# EasyEDA Pro project ProPrj_PCB-rocket-flight-controller_2026-04-01.epro, board PCB_rocket flight controller_2
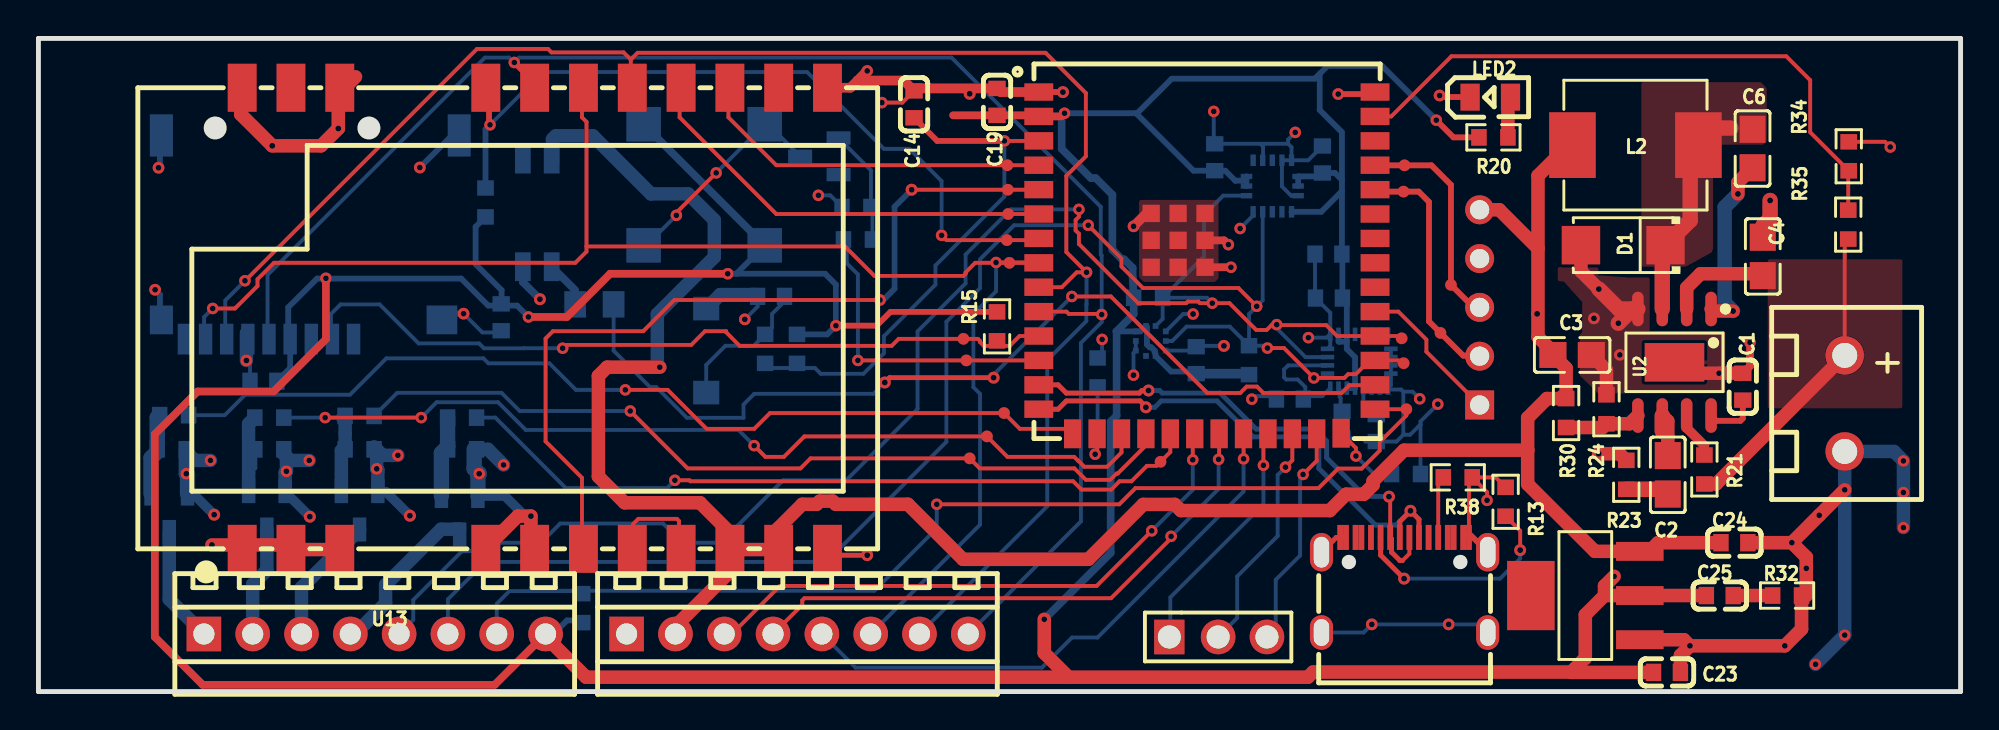
[diagram p2: board, top side]
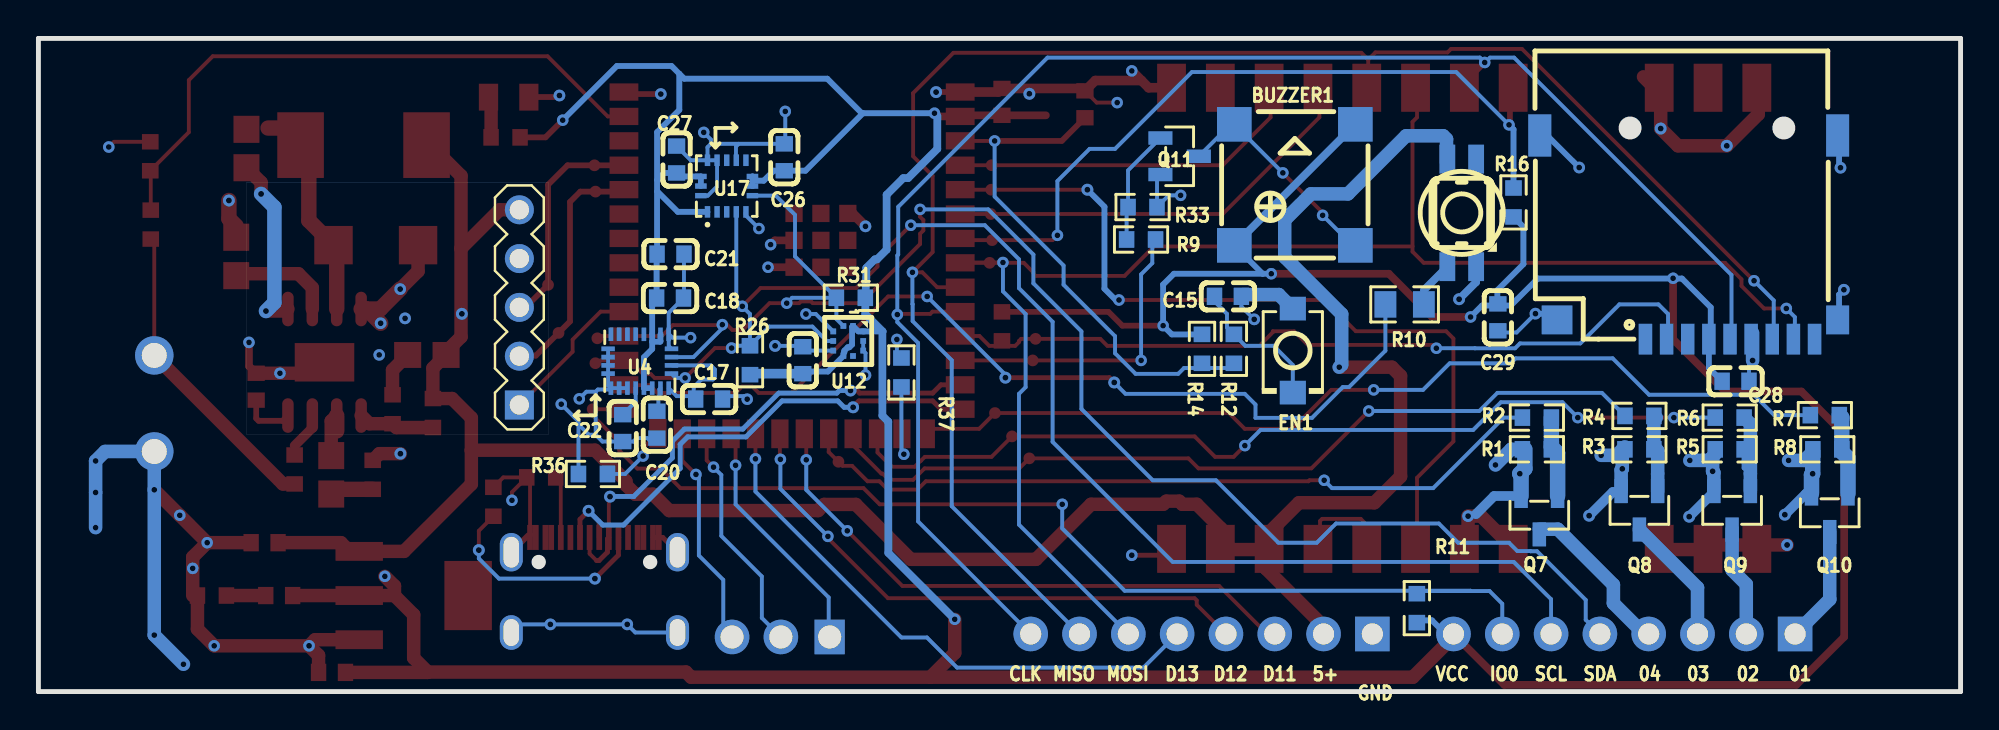
[diagram p3: board, bottom side, seen from below]

Outline 100.03 x 34 mm; copper layers: Top Layer, Inner1, Inner2, Bottom Layer. Coordinates in mm from the lower left corner of the outline.
Outline path: 0,34 100.03,34 100.03,0 0,0 0,34
Stack: Top Layer 0.035mm Outer layer thickness 1oz / Dielectric1 0.2104mm 7628 RC49% 8.6mil / Inner1 0.0152mm Inner layer thickness / Dielectric2 1.065mm 1.1mm H/HOZ Copper / Inner2 0.0152mm Inner layer thickness / Dielectric3 0.2104mm 7628 RC49% 8.6mil / Bottom Layer 0.035mm Outer layer thickness 1oz

## Design rules (mm)
net D+: DP1
net D-: DP1
template: User Custom Config
spacing Default (default): track to track 0.2, other pairs 0 to 0.305
track width Default (default): min 0.2, default 0.2, max 25.4
track width trackWidth2: min 0.7, default 0.7, max 2.54
track width trackWidthvcc: min 0.25, default 0.3, max 2.54
differential pair differentialPair (default): width min 0.127, default 0.254, max 2.54; gap min 0.152, default 0.152
via Default (default): diameter min 0.6, default 0.6, max 100.025; hole min 0.3, default 0.3, max 59.995
net VCC uses trackWidthvcc
net +5V uses trackWidth2
pour e791 uses gge18691
pour e793 uses gge18697
pour e795 uses gge18697(1)
pour e796 uses gge18745
pour e798 uses gge18751
pour e802 uses gge382696

## Placement (name value [footprint] x y rotation side)
BUZZER1  2.7kHz  [BUZ-SMD_4P-L7.5-W7.5-BR]  34.65 26.38 270 bottom
C1  100nF  [C0603]  88.7 15.87 90 top
C2  6.8nF  [C0805]  84.79 11.28 270 top
C3  47uF  [C0805]  79.81 17.52 0 top
C4  4.7uF  [C0805]  89.74 22.65 270 top
C6  10nF  [C0805]  89.2 28.27 90 top
C12  100nF  [C0603]  60.25 17.25 90 bottom
C14  1uF  [C0603]  45.57 30.57 90 top
C15  100nF  [C0603]  38.13 20.57 0 bottom
C17  100nF  [C0603]  65.13 15.23 180 bottom
C18  100nF  [C0603]  67.16 20.48 0 bottom
C19  100nF  [C0603]  49.89 30.69 90 top
C20  100nF  [C0603]  67.84 13.89 90 bottom
C21  10nF  [C0603]  67.13 22.77 180 bottom
C22  10nF  [C0603]  69.62 13.71 270 bottom
C23  100nF  [C0603]  84.75 1 180 top
C24  100nF  [C0603]  88.26 7.75 180 top
C25  22uF  [C0603]  87.5 5 0 top
C26  100nF  [C0603]  61.21 27.81 270 bottom
C27  100nF  [C0603]  66.82 27.7 90 bottom
C28  1uF  [C0603]  11.71 16.15 0 bottom
C29  1uF  [C0603]  24.08 19.48 270 bottom
CARD1  TF PUSH  [TF-SMD_TF-PUSH]  14.15 23.65 0 bottom
D1  M7  [SMA_L4.3-W2.6-LS5.2-RD]  82.47 23.24 180 top
EN1  TS-1088-AR02016  [SW-SMD_L3.9-W3.0-P4.45]  34.75 17.75 270 bottom
L2  10uH  [IND-SMD_L7.3-W6.6]  83.11 28.44 0 top
LED1  SK6812MINI-E  [LED-SMD_L3.2-W2.8-LS5.9_SK6812MINI-E]  25.96 24.92 90 bottom
LED2  NCD0805G1  [LED0805-R-RD]  75.56 30.94 0 top
NOREF  -  [Pad_e1368]  71.04 26.02 0 top
NOREF#2  -  [Pad_e1339]  71.09 27.39 0 top
NOREF#3  -  [Pad_e2091]  71.04 17.09 0 top
NOREF#4  -  [Pad_e1498]  71.19 14.7 0 top
NOREF#5  -  [Pad_e1382]  72.96 18.67 0 top
NOREF#6  -  [Pad_e1448]  50.4 23.5 0 top
NOREF#7  -  [Pad_e1465]  50.53 22.32 0 top
NOREF#8  -  [Pad_e1434]  50.47 24.86 0 top
NOREF#9  -  [Pad_e1487]  58.39 11.96 0 top
NOREF#10  -  [Pad_e527]  48.29 17.24 0 top
NOREF#11  -  [Pad_e2089]  70.94 18.39 0 top
NOREF#12  -  [Pad_e518]  48.14 18.36 0 top
NOREF#13  -  [Pad_e1485]  50.25 14.5 0 top
NOREF#14  -  [Pad_e515]  48.46 12.14 0 top
NOREF#15  -  [Pad_e1402]  50.45 26.12 0 top
NOREF#16  -  [Pad_e514]  49.36 13.28 0 top
NOREF#17  -  [Pad_e1417]  50.42 27.4 0 top
NOREF#18  -  [Pad_e1381]  73.51 21.17 0 top
P2  WJ126V-5.0-2P  [CONN-TH_WJ126V-5.0-2P]  94 15 0 top
Q7  IRLML6344TRPBF-HXY  [SOT-23-3_L2.9-W1.3-P1.90-LS2.4-BR-1]  21.92 9.18 90 bottom
Q8  IRLML6344TRPBF-HXY  [SOT-23-3_L2.9-W1.3-P1.90-LS2.4-BR-1]  16.71 9.43 90 bottom
Q9  IRLML6344TRPBF-HXY  [SOT-23-3_L2.9-W1.3-P1.90-LS2.4-BR-1]  11.89 9.43 90 bottom
Q10  IRLML6344TRPBF-HXY  [SOT-23-3_L2.9-W1.3-P1.90-LS2.4-BR-1]  6.81 9.31 90 bottom
Q11  IRLML6344TRPBF-HXY  [SOT-23-3_L2.9-W1.3-P1.90-LS2.4-BR-1]  40.64 27.86 0 bottom
R1  10kΩ  [R0603]  22.05 12.61 180 bottom
R2  100Ω  [R0603]  22.05 14.26 0 bottom
R3  10kΩ  [R0603]  16.71 12.61 180 bottom
R4  100Ω  [R0603]  16.71 14.35 0 bottom
R5  10kΩ  [R0603]  12.02 12.61 180 bottom
R6  100Ω  [R0603]  12.02 14.26 0 bottom
R7  100Ω  [R0603]  7.06 14.39 0 bottom
R8  10kΩ  [R0603]  6.94 12.61 180 bottom
R9  100Ω  [R0603]  42.65 23.53 180 bottom
R10  330Ω  [R0805]  28.93 20.15 0 bottom
R11  10kΩ  [R0603]  28.3 4.34 90 bottom
R12  470Ω  [R0603]  37.82 17.84 270 bottom
R13  5.1kΩ  [R0603]  76.35 9.88 90 top
R14  10kΩ  [R0603]  39.48 17.84 90 bottom
R15  10kΩ  [R0603]  49.89 19.01 90 top
R16  10kΩ  [R0603]  23.27 25.46 90 bottom
R20  470Ω  [R0603]  75.72 28.85 180 top
R21  100kΩ  [R0603]  86.7 11.56 270 top
R23  6.8kΩ  [R0603]  82.63 11.28 90 top
R24  10kΩ  [R0603]  81.6 14.7 270 top
R26  4.7kΩ  [R0603]  63 17.25 270 bottom
R30  44.2kΩ  [R0603]  79.5 14.5 90 top
R31  4.7kΩ  [R0603]  57.75 20.5 180 bottom
R32  1Ω  [R0603]  91 5 0 top
R33  10kΩ  [R0603]  42.57 25.22 180 bottom
R34  68kΩ  [R0603]  94.21 27.86 270 top
R35  180kΩ  [R0603]  94.18 24.31 270 top
R36  10kΩ  [R0603]  71.17 11.33 180 bottom
R37  10kΩ  [R0603]  55.12 16.61 90 bottom
R38  5.1kΩ  [R0603]  73.86 11.15 180 top
SERVO3  77311-102-03LF  [HDR-TH_3P-P2.54-V-M-1]  61.39 2.84 0 top
U2  MP1484  [SOP-8_L4.9-W3.9-P1.27-LS6.0-BL-EP3.1]  85.14 17.14 180 top
U4  LSM9DS1TR  [LGA-24_L3.5-W3.0-P0.43-TL]  68.73 17.19 0 bottom
U5  ESP32-S3-WROOM-1U-N8  [WIRELM-SMD_ESP32-S3-WROOM-1U]  60.81 22.31 0 top
U6  GPS Module GPS NEO-6M  [GPS MODULE GPS NEO-6M]  75 20 0 bottom
U12  BMP581  [LGA-10_L2.0-W2.0-P0.50-TL_BMP581]  57.89 18.25 270 bottom
U13  DB125-2.54-8P-GN-S  [CONN-TH_DB125-2.54-8P-GN]  17.5 3 0 top
U15  DB125-2.54-8P-GN-S  [CONN-TH_DB125-2.54-8P-GN]  39.5 3 0 top
U16  AMS1117-3.3  [SOT-223-4_L6.5-W3.5-P2.30-LS7.0-BR]  80.5 5 0 top
U17  H3LIS331DLTR  [LGA-16_L3.0-W3.0-P0.50-BL]  64.21 26.31 180 bottom
U18  E220-900M30S  [WIRELM-SMD_E22-900M30S]  25.83 19.43 270 top
USBC1  TYPE-C-31-M-12  [USB-C_SMD-TYPE-C-31-M-12]  71.1 5.55 0 top

## Footprints (pads in the part's own frame, mm; a bottom-side part is the same pattern mirrored in y, then rotated)
BUZ-SMD_4P-L7.5-W7.5-BR
  rect 1.8x1.8 smd: 1(3.15,-3.15) 2(3.15,3.15) 3(-3.15,3.15) 4(-3.15,-3.15)
C0603
  rect 0.8x0.9 smd: 1(-0.7,0) 2(0.7,0)
C0805
  rect 1.41x1.35 smd: 1(-1,0) 2(1,0)
CONN-TH_DB125-2.54-8P-GN
  rect 1.8x1.8 hole 1.1: 1(-8.89,0)
  round 1.8 hole 1.1: 2(-6.35,0) 3(-3.81,0) 4(-1.27,0) 5(1.27,0) 6(3.81,0) 7(6.35,0) 8(8.89,0)
CONN-TH_WJ126V-5.0-2P
  round 2 hole 1.3: 1(0,2.501) 2(0,-2.501)
GPS MODULE GPS NEO-6M
  rect 1.508x1.508 hole 1x1: 1(0,5.08)
  round 1.508 hole 1x1: 2(0,2.54) 3(0,0) 4(0,-2.54) 5(0,-5.08)
HDR-TH_3P-P2.54-V-M-1
  rect 1.575x1.8 hole 1.2: 1(-2.54,0)
  round 1.8 hole 1.2: 2(0,0) 3(2.54,0)
IND-SMD_L7.3-W6.6
  rect 2.424x3.42 smd: 1(3.278,0) 2(-3.278,0)
LED0805-R-RD
  rect 1x1.399 smd: 1(1.05,0) 2(-1.05,0)
LED-SMD_L3.2-W2.8-LS5.9_SK6812MINI-E
  rect 1.5x0.82 smd: 1(2.8,0.75) 2(2.8,-0.75) 3(-2.8,-0.75) 4(-2.8,0.75)
LGA-10_L2.0-W2.0-P0.50-TL_BMP581
  rect 0.3x0.3 smd: 1(-0.78,0.25) 2(-0.78,-0.25) 3(-0.5,-0.78) 4(0,-0.78) 5(0.5,-0.78) 6(0.78,-0.25) 7(0.78,0.25) 8(0.5,0.78) 9(0,0.78) 10(-0.5,0.78)
LGA-16_L3.0-W3.0-P0.50-BL
  rect 0.28x0.6 smd: 1(-1,-1.343) 2(-0.5,-1.343) 3(0,-1.343) 4(0.5,-1.343) 5(1,-1.343) 9(1,1.343) 10(0.5,1.343) 11(0,1.343) 12(-0.5,1.343) 13(-1,1.343)
  rect 0.6x0.28 smd: 6(1.343,-0.5) 7(1.343,0) 8(1.343,0.5) 14(-1.343,0.5) 15(-1.343,0) 16(-1.343,-0.5)
LGA-24_L3.5-W3.0-P0.43-TL
  rect 0.241x0.7 smd: 1(-1.505,1.4) 6(-1.505,-1.4) 7(-1.075,-1.4) 8(-0.645,-1.4) 9(-0.215,-1.4) 10(0.215,-1.4) 11(0.645,-1.4) 12(1.075,-1.4) 13(1.505,-1.4) 18(1.505,1.4) 19(1.075,1.4) 20(0.645,1.4) 21(0.215,1.4) 22(-0.215,1.4) 23(-0.645,1.4) 24(-1.075,1.4)
  rect 0.7x0.241 smd: 2(-1.65,0.645) 3(-1.65,0.215) 4(-1.65,-0.215) 5(-1.65,-0.645) 14(1.65,-0.645) 15(1.65,-0.215) 16(1.65,0.215) 17(1.65,0.645)
Pad_e514
  round 0.61 smd: TP1(0,0)
Pad_e515
  round 0.61 smd: TP2(0,0)
Pad_e518
  round 0.61 smd: TP3(0,0)
Pad_e527
  round 0.61 smd: TP4(0,0)
Pad_e1339
  round 0.61 smd: TP1(0,0)
Pad_e1368
  round 0.61 smd: TP2(0,0)
Pad_e1381
  round 0.61 smd: TP3(0,0)
Pad_e1382
  round 0.61 smd: TP4(0,0)
Pad_e1402
  round 0.61 smd: TP5(0,0)
Pad_e1417
  round 0.61 smd: TP6(0,0)
Pad_e1434
  round 0.61 smd: TP7(0,0)
Pad_e1448
  round 0.61 smd: TP8(0,0)
Pad_e1465
  round 0.61 smd: TP9(0,0)
Pad_e1485
  round 0.61 smd: TP11(0,0)
Pad_e1487
  round 0.61 smd: TP13(0,0)
Pad_e1498
  round 0.61 smd: TP14(0,0)
Pad_e2089
  round 0.61 smd: TP1(0,0)
Pad_e2091
  round 0.61 smd: TP2(0,0)
R0603
  rect 0.806x0.864 smd: 1(-0.753,0) 2(0.753,0)
R0805
  rect 1.133x1.377 smd: 1(-1,0) 2(1,0)
SMA_L4.3-W2.6-LS5.2-RD
  rect 2x2 smd: 1(-2.2,0) 2(2.2,0)
SOP-8_L4.9-W3.9-P1.27-LS6.0-BL-EP3.1
  oval 0.6x1.8 smd: 1(-1.905,-2.772) 2(-0.635,-2.772) 3(0.635,-2.772) 4(1.905,-2.772) 5(1.905,2.772) 6(0.635,2.772) 7(-0.635,2.772) 8(-1.905,2.772)
  rect 3.1x2 smd: 9(0,0)
SOT-23-3_L2.9-W1.3-P1.90-LS2.4-BR-1
  rect 1.25x0.7 smd: 1(1,-0.95) 2(1,0.95) 3(-1,0)
SOT-223-4_L6.5-W3.5-P2.30-LS7.0-BR
  rect 2.47x0.98 smd: 1(2.835,-2.3) 2(2.835,0) 3(2.835,2.3)
  rect 2.47x3.6 smd: 4(-2.835,0)
SW-SMD_L3.9-W3.0-P4.45
  rect 1.23x1.36 smd: 1(-2.185,0) 2(2.185,0)
TF-SMD_TF-PUSH
  rect 0.7x1.6 smd: 1(2.25,5.3) 2(1.15,5.3) 3(0.05,5.3) 4(-1.05,5.3) 5(-2.15,5.3) 6(-3.25,5.3) 7(-4.35,5.3) 8(-5.45,5.3) CD(-6.55,5.3)
  rect 1.2x1.5 smd: 10(-7.75,4.3)
  rect 1.2x2.2 smd: 11(-7.75,-5.3) 12(7.75,-5.3)
  rect 1.6x1.5 smd: 13(6.85,4.3)
USB-C_SMD-TYPE-C-31-M-12
  oval 1.2x2 hole 0.8x1.6: 0(-4.325,1.706) 1(4.325,1.706)
  oval 1.2x1.8 hole 0.8x1.4: 2(4.325,-2.474) 3(-4.325,-2.474)
  rect 0.3x1.3 smd: A1(-3.35,2.474) A4(-2.55,2.474) A5(-1.25,2.474) A6(-0.25,2.474) A7(0.25,2.474) A8(1.25,2.474) A9(2.55,2.474) A12(3.35,2.474) B1(3.05,2.474) B4(2.25,2.474) B5(1.75,2.474) B6(0.75,2.474) B7(-0.75,2.474) B8(-1.75,2.474) B9(-2.25,2.474) B12(-3.05,2.474)
WIRELM-SMD_E22-900M30S
  rect 2.5x1.5 smd: 1(12,-15.23) 2(12,-12.69) 3(12,-10.15) 4(12,-2.55) 5(12,-0.01) 6(12,2.53) 7(12,5.07) 8(12,7.61) 9(12,10.15) 10(12,12.69) 11(12,15.23) 12(-12,15.23) 13(-12,12.69) 14(-12,10.15) 15(-12,7.61) 16(-12,5.07) 17(-12,2.53) 18(-12,-0.01) 19(-12,-2.55) 20(-12,-10.15) 21(-12,-12.69) 22(-12,-15.23)
WIRELM-SMD_ESP32-S3-WROOM-1U
  rect 1.5x0.9 smd: 1(-8.75,8.895) 2(-8.75,7.625) 3(-8.75,6.355) 4(-8.75,5.085) 5(-8.75,3.815) 6(-8.75,2.545) 7(-8.75,1.275) 8(-8.75,0.005) 9(-8.75,-1.265) 10(-8.75,-2.535) 11(-8.75,-3.805) 12(-8.75,-5.075) 13(-8.75,-6.345) 14(-8.75,-7.615) 27(8.75,-7.615) 28(8.75,-6.345) 29(8.75,-5.075) 30(8.75,-3.805) 31(8.75,-2.535) 32(8.75,-1.265) 33(8.75,0.005) 34(8.75,1.275) 35(8.75,2.545) 36(8.75,3.815) 37(8.75,5.085) 38(8.75,6.355) 39(8.75,7.625) 40(8.75,8.895)
  rect 0.9x1.5 smd: 15(-6.985,-8.895) 16(-5.715,-8.895) 17(-4.445,-8.895) 18(-3.175,-8.895) 19(-1.905,-8.895) 20(-0.635,-8.895) 21(0.635,-8.895) 22(1.905,-8.895) 23(3.175,-8.895) 24(4.445,-8.895) 25(5.715,-8.895) 26(6.985,-8.865)
  rect 0.9x0.9 smd: 41(-2.9,2.575) 41(-2.9,1.175) 41(-2.9,-0.225) 41(-1.5,2.575) 41(-1.5,1.175) 41(-1.5,-0.225) 41(-0.1,2.575) 41(-0.1,1.175) 41(-0.1,-0.225)

## Nets
+5V: C3.1 C24.2 L2.2 LED1.1 R30.2 U6.5 U15.2 U16.3 U18.9 U18.10
GND: C1.2 C3.2 C4.1 C12.2 C14.2 C15.1 C17.2 C18.1 C19.2 C20.1 C21.2 C22.2 C23.1 C24.1 C26.1 C27.2 C28.1 C29.2 CARD1.6 CARD1.10 CARD1.11 CARD1.12 CARD1.13 D1.2 EN1.1 LED1.3 LED2.2 P2.2 Q7.2 Q8.2 Q9.2 Q10.2 Q11.2 R1.1 R3.1 R5.1 R8.1 R13.2 R23.2 R24.1 R32.2 R33.2 R34.1 R36.1 R37.2 R38.1 U2.4 U2.9 U4.5 U4.6 U4.14 U4.15 U4.16 U4.17 U4.18 U4.19 U4.20 U5.1 U5.40 U5.41 U6.4 U12.3 U12.5 U12.8 U12.9 U15.1 U16.1 U17.5 U17.10 U17.12 U17.13 U17.16 U18.1 U18.2 U18.3 U18.4 U18.5 U18.11 U18.12 U18.20 U18.22 USBC1.0 USBC1.1 USBC1.2 USBC1.3 USBC1.A1 USBC1.A12 USBC1.B1 USBC1.B12
VBATT: C4.2 P2.1 R21.2 R35.2 U2.2
VCC: BUZZER1.1 BUZZER1.3 C12.1 C18.2 C19.1 C21.1 C23.2 C25.1 C26.2 C27.1 C28.2 C29.1 CARD1.4 R11.1 R14.2 R15.2 R16.1 R20.2 R26.2 R31.2 U4.7 U4.8 U4.22 U4.23 U5.2 U12.1 U12.6 U12.10 U13.8 U16.2 U17.1 U17.7 U17.8 U17.14 U17.15
CLK: CARD1.5 U5.10 U15.8 U18.18
D03PIRO1: NOREF#13.TP11 R7.2 U5.15
D4BUSY: NOREF#17.TP6 U5.4 U18.14
D5RXEN: NOREF#15.TP5 U5.5 U18.6
D6NRST: NOREF#8.TP7 U5.6 U18.15
D7CS(LORA): NOREF#6.TP8 R16.2 U5.7 U18.19
D8BUZZERPIN: NOREF#10.TP4 R9.2 U5.12
D9PIRO3: NOREF#14.TP2 R4.2 U5.18
D10PIRO4: NOREF#9.TP13 R2.2 U5.19
D12SERVO1: U5.20 U15.3
D13SERVO2: U5.21 U15.4
D14SERVO3: U5.22 U15.5
D18CSSDCARD: CARD1.2 NOREF#12.TP3 R15.1 U5.11
D21: SERVO3.1 U5.23
D39LED: R10.2 U5.28
D40SCL: NOREF#3.TP2 R26.1 U4.2 U5.29 U12.4 U13.6 U17.4
D41SDA: NOREF#11.TP1 R31.1 U4.4 U5.30 U12.2 U13.5 U17.6
D46PIRO2: NOREF#16.TP1 R6.2 U5.17
D47: SERVO3.2 U5.24
D48: SERVO3.3 U5.25
D+: U5.14 USBC1.A6 USBC1.B6
D-: U5.13 USBC1.A7 USBC1.B7
EN: C14.1 R12.2 R14.1 U5.3
IO0: NOREF#4.TP14 R11.2 U5.27 U13.7
MISO: CARD1.7 U5.9 U15.7 U18.16
MOSI: CARD1.8 NOREF#7.TP9 U5.8 U15.6 U18.17
PIRO1-: Q10.3 U13.1
PIRO2-: Q9.3 U13.2
PIRO3-: Q8.3 U13.3
PIRO4-: Q7.3 U13.4
PPS: U5.31 U6.1
RX: NOREF.TP2 NOREF#5.TP4 U5.36 U6.2
TX: NOREF#2.TP1 NOREF#18.TP3 U5.37 U6.3
V: R34.2 R35.1 U5.39
$1N5: C15.2 EN1.2 R12.1
$1N13: R21.1 U2.7
$1N14: C1.1 U2.8
$1N15: C2.1 U2.6
$1N16: C6.2 D1.1 L2.1 U2.3
$1N18: R24.2 R30.1 U2.5
$1N20: C6.1 U2.1
$1N1285: C2.2 R23.1
$1N7934: C25.2 R32.1
$1N12300: U18.7 U18.8
$1N13611: R36.2 U5.26
$1N13616: R37.1 U5.16
$1N14866: R13.1 USBC1.A5
$1N14869: R38.2 USBC1.B5
$2N1: Q7.1 R1.2 R2.1
$2N2: Q8.1 R3.2 R4.1
$2N3: Q9.1 R5.2 R6.1
$2N4: Q10.1 R7.1 R8.2
$2N19: C17.1 U4.1 U4.3
$2N22: C20.2 U4.24
$2N907: LED1.4 R10.1
$2N956: LED2.1 R20.1
$2N973: C22.1 U4.21
$2N3959: BUZZER1.2 BUZZER1.4 Q11.3
$2N14318: Q11.1 R9.1 R33.1

Pads without a net: CARD1 1 3 CD; LED1 2; U4 9 10 11 12 13; U5 32 33 34 35 38; U12 7; U16 4; U17 2 3 9 11; U18 13 21; USBC1 A4 A8 A9 B4 B8 B9

## Via types
v1: diameter 0.6, hole 0.3, Top Layer to Bottom Layer, 80 vias
v2: diameter 0.61, hole 0.305, Top Layer to Bottom Layer, 20 vias
v3: diameter 0.62, hole 0.31, Top Layer to Bottom Layer, 25 vias
v4: diameter 0.6, hole 0.31, Top Layer to Bottom Layer, 2 vias

## Routing (per net, layer and track width the routed paths; a pad name or vN(x,y) marks a point on that pad's centre or on a via; arc(x,y) is an arc through that point)
+5V: length 126.4
  Top Layer w0.7: 38.5,7.07 38.5,8.5 39.75,9.75 40.5,9.75 40.66,9.91 41.33,9.91 41.49,9.75 45.25,9.75 48.11,6.88 54.64,6.88 57.49,9.74 59.14,9.74 59.46,9.42 67.2,9.42 68.05,10.27 68.97,10.27 69.45,10.75 69.45,10.95 71.07,12.56 77.5,12.56 ; 78.04,23.07 76.03,25.08 U6.5 ; 78.04,23.07 78.04,26.85 79.76,28.57 ; 78.04,23.07 78.04,18.46 78.81,17.68 ; C3.1 79.5,16.84 R30.2 78.5,15.25 77.5,14.25 77.5,12.56 ; 77.5,12.56 77.5,10.8 81,7.3 83.33,7.3 ; v1(32.33,16.88) 29.59,16.88 29.14,16.43 29.14,11.19 30.51,9.83 34.43,9.83 36.15,8.11 36.15,7.39 ; U15.2 33.15,3.4 36.15,6.4 36.15,7.39 ; 36.15,7.39 38.45,7.39 ; 83.83,7.3 84.29,7.75 C24.2
  Bottom Layer w0.7: v1(32.33,16.88) 32.21,17.01 32.21,19.65 35.17,22.61 35.17,24.54 33.81,25.91 31.88,25.91 28.85,28.93 26.92,28.93 26.75,28.76 26.75,27.55
  vias: v3(77.99,19.66)
GND: length 216.4
  Top Layer w0.2: USBC1.A12 74.45,10.98 R38.1 ; R38.1 75.84,11.15 R13.2 ; R38.1 75.39,10.38 v1(75.39,9.96) ; USBC1.B1 74.3,8.17 ; 94.21,28.62 96.1,28.62 v1(96.37,28.35) ; C14.2 44.96,30.66 v1(43.89,30.66)
  Top Layer w0.254: USBC1.B12 USBC1.A1 67.54,8.02 USBC1.0 ; v2(43.13,7.1) 41.28,7.1 40.99,7.39
  Top Layer w0.3: v2(72.92,31.03) 73,30.95 74.5,30.95 LED2.2 ; v2(67.64,31.1) 69.17,31.1 69.17,31.1 ; U5.1 53.31,31.21 v3(53.32,31.2) ; USBC1.1 74.55,8.13
  Top Layer w0.4: U5.41 v1(62.06,22.09) ; v1(89.07,18.18) 89.07,16.95 C1.2 ; v1(61.93,23.27) 61.7,23.49 U5.41
  Top Layer w0.5: U18.12 42.25,31.43 42.63,31.81 ; C14.2 45.03,31.81 42.63,31.81 ; 42.63,31.81 v1(43.13,32.31) ; U5.41 57.66,24.89 v2(56.99,24.22) ; 45.7,31.39 C19.2 50.07,31.21 U5.1
  Top Layer w0.7: v2(85.95,2.38) 85.45,1.89 C23.1 ; v2(85.95,2.38) v1(90.88,2.38) 91.75,3.25 91.75,5 ; v2(85.95,2.38) 85.63,2.7 83.33,2.7 ; C24.1 v1(91.25,7.75) ; v1(91.25,7.75) 92,7 v1(92,6.41) 92,5 ; v1(91.25,7.75) v1(92.67,9.18) v1(94,10.5) ; R24.1 81.6,16.74 C3.2 ; 25.8,7.07 25.63,7.24 v2(25.63,9.13) 24.95,9.13 23.21,7.39 ; 10.53,31.39 10.53,30.05 v3(12.17,28.41) 14.71,28.41 v3(15.61,29.31) 15.61,31.1 16.5,32 ; U2.9 85.71,16.57 v1(87.46,16.57) C1.2 ; v2(81.2,20.95) 80.27,21.88 80.27,23.24 ; v3(81.19,12.38) 82.29,12.38 R23.2 ; 15.61,7.39 13.07,7.39 12.83,7.63 v3(9.03,7.63)
  Top Layer w0.8: v2(81.2,20.95) 82.24,19.91 82.96,19.91 ; v3(90.12,25.56) 90.12,24.62 89.74,24.24 ; 82.96,19.91 v2(82.22,19.17) ; 82.96,19.91 83.24,19.91
  Bottom Layer w0.2: 66.43,22.77 66.43,20.51 C18.1 67.23,19.71 U4.6 67.23,17.98 U4.5 ; 71.03,15.61 70.92,15.72 70.31,15.72 U4.18 ; 71.03,15.61 71.51,15.61 v1(71.88,15.24) ; 71.03,15.61 71.03,13.37 ; Q11.2 41.82,26.74 R33.2 41.21,25.83 v1(40.59,25.83) ; USBC1.2 75,3.5 v2(73.39,3.5) v2(69.39,3.5) 68.96,3.07 USBC1.3 ; U4.18 70.38,15.94 U4.17 U4.16 U4.15 U4.14 ; U4.18 U4.19 U4.20 ; U17.13 66.08,27.66 C27.2 ; U17.13 U17.12 64.71,26.3 65.19,25.81 U17.16 ; U17.13 65.21,28.34 65.04,28.51 ; 60.3,18.06 60.37,17.99 v3(61.69,17.99) ; R36.1 71.92,13.91 ; 71.92,13.91 71.92,14.06 v1(72.82,14.96) ; 71.92,13.91 71.38,13.37 71.03,13.37 ; U12.5 59.99,17.75 60.3,18.06 ; 65.04,28.51 65.04,28.74 v1(65.41,29.11) ; 65.04,28.51 63.59,28.51 ; v1(63.14,15.22) 63.3,15.38 64.53,15.38 ; 71.03,13.37 70.67,13.01 C22.2 69.06,13.01 68.88,13.19 68.34,13.19 68.16,13.01 67.79,13.01 67.77,13.04 ; v1(61.16,30.2) 61.16,28.56 C26.1 63.59,28.51 ; 24.11,18.69 23.1,18.69 v2(22.12,19.67) ; 55.12,17.29 55.36,17.52 v1(55.36,18.33) ; 63.59,28.51 63.73,28.37 63.73,27.67 U17.10 ; U12.9 U12.8 ; v1(66.09,18.42) 67.04,18.42 67.21,18.59 ; v1(62.54,24.1) 63.21,24.78 U17.5 ; v4(60.09,19.65) 59.57,19.65 U12.3 ; v3(10.82,17.23) 11.01,17.05 C28.1 ; 57.11,17.74 56.99,17.62 v4(56.99,16.47) ; v2(36.76,19.38) 37.43,20.04 C15.1
  Bottom Layer w0.3: v2(6.07,20.92) 6.32,20.66 6.32,19.66 ; 20.92,19.66 22.12,19.66 v2(22.12,19.67) ; v2(19.85,27.28) 21.82,29.25 21.82,29.26 ; 6.32,29.26 6.32,27.34 v2(6.25,27.27)
  Bottom Layer w0.4: v3(26.1,20.42) 25.21,21.31 LED1.3
  Bottom Layer w0.5: Q7.2 24.27,10.18 25.22,9.23 ; 12.84,10.39 v3(14.12,9.1) ; v3(19.33,9.16) 18.1,10.39 17.66,10.39 ; Q10.2 8.04,10.31 v3(9.14,9.21)
  Bottom Layer w0.7: EN1.1 35.48,20.67 37.33,20.67 ; 12.77,12.36 13.09,12.03 v1(14.09,12.03) ; 10.82,18.66 v3(10.82,17.23) ; 17.6,12.6 v2(17.6,11.59) 17.66,11.53 Q8.2 ; v1(97.05,8.53) v1(97.05,10.36) v1(97.05,12.01) 96.56,12.5 P2.2 v1(94,10.5) v1(94,2.94) v1(92.48,1.42) ; Q9.2 12.84,11.4 v2(12.9,11.47) 12.9,12.22 ; 7.69,12.48 8.14,12.03 v1(8.95,12.03) ; v1(24.2,11.8) 23.39,12.61 22.67,12.61 ; 17.47,12.74 17.91,12.3 v1(18.7,12.3)
  Bottom Layer w0.8: Q10.2 7.76,11.28 v2(7.7,11.34) 7.69,12.48 ; 22.67,12.61 22.67,11.6 v2(22.94,11.34) 22.87,11.27 Q7.2
  vias: v1(82.3,17.52) v2(80.95,19.43) v3(48.46,31.12)
VBATT: length 21.6
  Top Layer w0.2: P2.1 94,23.37 R35.2
  Top Layer w0.7: P2.1 87.31,10.81 R21.2 ; 85.78,19.91 85.78,21 ; C4.2 89.64,21.75 86.5,21.75 85.78,21.02
VCC: length 288.1
  Top Layer w0.3: R20.2 73.64,28.85 v1(72.75,29.74) ; 49.89,19.76 44.34,19.76 43.62,19.05 v1(41.5,19.05)
  Top Layer w0.4: v1(53.4,30.1) 53.23,29.94 52.06,29.94 52,29.99 C19.1 47.6,29.99 ; U13.8 23.74,0.35 8.55,0.35 6.06,2.84 6.06,13.4 8.28,15.62 12.24,15.62 14.96,18.34 v1(14.96,21.51) ; v1(35.87,21.75) 29.75,21.75 27.5,19.5 v1(25.5,19.5)
  Top Layer w0.7: 81.5,5 80.5,4 80.5,1.75 79.77,1.02 ; 81.5,5 81.5,5.5 v1(82,6) ; 81.5,5 C25.1 ; 53.61,0.75 52.34,2.01 v1(52.34,3.76) ; 53.61,0.75 66.06,0.75 66.33,1.02 79.77,1.02 ; 53.61,0.75 28.5,0.75 26.39,2.86 U13.8 ; 79.77,1.02 79.79,1 C23.2
  Bottom Layer w0.3: 66.68,32.16 66.68,30.27 67.83,29.12 67.83,26.63 ; 66.68,32.16 66.42,31.9 58.98,31.9 57.18,30.1 57.12,30.1 ; 66.68,32.16 67.08,32.56 69.93,32.56 v1(72.75,29.74) ; U17.15 U17.14 66.64,26.81 C27.1 67.47,27 67.83,26.63 ; 68.09,18.21 68.09,17.83 68.52,17.4 U4.22 68.17,15.79 ; 68.09,18.21 67.68,18.21 67.66,18.23 U4.7 ; 68.09,18.21 U4.8 68.09,20.25 C18.2 67.86,22.74 C21.1 67.83,26.02 ; 36.32,21.75 v1(35.87,21.75) ; 36.32,21.75 BUZZER1.1 ; 36.32,21.75 40.94,21.75 41.5,21.19 v1(41.5,19.05) 41.05,18.59 R14.2 ; 67.83,26.63 67.83,26.02 ; 13.02,18.66 13,18.69 13,20 14.5,21.5 22,21.5 23.41,20.09 24.11,20.09 ; 67.83,26.02 67.81,26.02 66.76,24.97 U17.1 ; U17.7 U17.8 62.65,26.59 62.28,26.59 61.76,27.11 C26.2 60.11,27.11 57.12,30.1 ; 57.12,30.1 v1(53.4,30.1) ; U13.8 26.8,3 27.51,3.71 28.18,3.71 R11.1 ; 58.13,17.62 58.09,17.66 58.09,17.74 57.91,17.92 57.83,17.92 57.69,18.06 57.69,18.98 57.64,19.03 57.36,18.75 U12.10 56.1,18.75 ; 24.11,20.09 24.91,20.09 v1(25.5,19.5) ; 24.11,20.09 24.11,20.89 22.75,22.25 22.75,24.19 R16.1 ; U12.6 58.95,16.66 60.3,16.66 ; C28.2 13.1,16.84 CARD1.4
  Bottom Layer w0.4: v1(52.34,3.76) 55.8,7.22 55.8,14.05 56.11,14.36 56.11,18.74 56.1,18.75 57,19.65 R31.2 56.95,21.55 56.95,22.05 56.5,22.5 56.39,22.5 55.89,23 55.89,25.86 55.02,26.73 54.77,26.73 53.25,28.25 53.25,29.96 v1(53.4,30.1) ; BUZZER1.3 BUZZER1.1
  Bottom Layer w0.5: R26.2 62.95,16.55 C12.1
CLK: length 85.2
  Top Layer w0.2: v1(55.33,19.62) 55.3,19.66 53.62,19.66 53.5,19.78 52.06,19.78
  Top Layer w0.3: v1(24.76,32.75) 25.75,31.76 25.75,30.89
  Bottom Layer w0.2: 11.92,18.66 11.92,21.69 23.23,33 24.49,33 24.74,32.75 v1(24.76,32.75) 25.02,33 47.52,33 55.28,25.23 55.28,22.75 55.33,22.7 v1(55.33,19.62) 55.33,19.23 54.25,18.15 54.25,8.86 U15.8
D03PIRO1: length 49.5
  Top Layer w0.2: 53.82,13.42 53.56,13.68 51.07,13.68 NOREF#13.TP11 38.07,14.5 37.25,13.68 34.77,13.68 32.75,15.7 v1(30.54,15.7)
  Bottom Layer w0.2: v1(30.54,15.7) 27.97,15.7 26.59,17.09 23.42,17.09 23.16,17.35 18.11,17.35 16.21,15.45 10.76,15.45 9.7,14.39 R7.2
D4BUSY: length 18.7
  Top Layer w0.2: 35.91,31.39 35.91,29.89 38.4,27.4 NOREF#17.TP6 52.06,27.4
D5RXEN: length 43.1
  Top Layer w0.2: v3(45.44,26.12) NOREF#15.TP5 52.05,26.12 U5.5 ; v1(43.8,20.38) 33.1,20.38 31.47,18.76 26.77,18.76 26.39,18.38 26.39,13.02 28.29,11.13 28.29,7.39
  Bottom Layer w0.3: v1(43.8,20.38) 43.97,20.38 44.55,20.97 44.55,25.23 v3(45.44,26.12)
D6NRST: length 22.3
  Top Layer w0.2: U5.6 NOREF#8.TP7 38.4,24.86 33.37,29.89 33.37,31.39
D7CS(LORA): length 40.4
  Top Layer w0.2: U5.7 51.97,23.5 NOREF#6.TP8 47.25,23.5 v1(47,23.75)
  Top Layer w0.3: 23.45,31.5 23.45,29.55 v1(23.5,29.5)
  Bottom Layer w0.2: v1(23.5,29.5) 26.25,32.25 40,32.25 44,28.25 45.33,28.25 47,26.57 v1(47,23.75)
  Bottom Layer w0.3: R16.2 23.27,29.26 v1(23.5,29.5)
D8BUZZERPIN: length 16
  Top Layer w0.2: v1(42.64,17.24) NOREF#10.TP4 52.06,17.24
  Bottom Layer w0.2: R9.2 42.06,23.36 42.06,22.3 42.64,21.72 v1(42.64,17.24)
D9PIRO3: length 44.3
  Top Layer w0.2: U5.18 57.63,12.82 56.16,11.35 56.1,11.35 55.77,11.02 54.51,11.02 53.91,11.62 48.99,11.62 NOREF#14.TP2 40.18,12.14 39.66,11.62 33.78,11.62 v1(30.8,14.6)
  Bottom Layer w0.2: v1(30.8,14.6) 25.05,14.6 24.1,15.55 18.67,15.55 R4.2
D10PIRO4: length 39.8
  Top Layer w0.2: v1(33.12,11) 33.88,11 33.94,10.95 53.85,10.95 54.28,10.51 55.83,10.51 56.26,10.95 56.88,10.95 57.69,11.75 58.18,11.75 NOREF#9.TP13 58.9,12.47 U5.19
  Bottom Layer w0.2: 22.8,14.26 23.78,14.26 27.45,10.59 32.71,10.59 v1(33.12,11)
D12SERVO1: length 30.4
  Top Layer w0.2: v1(57.94,8.37) 55.07,5.5 38.59,5.5 36.09,3 U15.3 ; v1(60.07,12.06) 60.07,13.32 U5.20
  Bottom Layer w0.2: v1(57.94,8.37) 60.07,10.5 v1(60.07,12.06)
D13SERVO2: length 29.7
  Top Layer w0.2: 61.44,13.42 61.44,12.11 v1(61.42,12.09) ; U15.4 39.75,4.52 39.75,4.75 39.86,4.86 55.82,4.86 59.03,8.07 59.15,8.07 59.14,8.08 v1(58.94,8.08)
  Bottom Layer w0.2: v1(58.94,8.08) 61.42,10.55 v1(61.42,12.09)
D14SERVO3: length 29.5
  Top Layer w0.2: U5.22 62.72,13.42 v1(62.72,12.11)
  Bottom Layer w0.2: v1(62.72,12.11) 62.72,10.42 55.11,2.81 53.79,2.81 52.22,1.25 42.52,1.25 U15.5
D18CSSDCARD: length 40.2
  Top Layer w0.2: v1(27.28,17.87) 27.45,18.05 33.97,18.05 34.68,18.76 35.79,18.76 35.79,18.71 36.49,17.99 44.4,17.99 44.77,18.36 NOREF#12.TP3 48.89,18.36 49,18.25 49,18.19 49.2,17.99 50.54,17.99 51.06,18.51 U5.11
  Bottom Layer w0.2: v1(27.28,17.87) 25.28,17.87 25.27,17.87 23.18,17.87 22.93,18.12 19.79,18.12 17.76,20.15 15.72,20.15 15.22,19.65 15.22,18.66
D21: length 12.7
  Top Layer w0.2: v1(63.75,11.78) 63.75,13.18 U5.23
  Bottom Layer w0.2: SERVO3.1 58.9,2.89 58.9,4.9 63.75,9.75 v1(63.75,11.78)
D39LED: length 49.1
  Top Layer w0.2: v1(53.78,20.57) 55.81,20.57 60.83,15.54 62.54,15.54 62.87,15.87 63.42,15.87 63.75,15.54 67.82,15.54 68.23,15.95 69.54,15.95 U5.28
  Top Layer w0.25: v3(49.71,16.34) 44.29,16.34 v3(44.04,16.09)
  Bottom Layer w0.2: v3(49.71,16.34) 49.71,16.49 v1(53.78,20.57) ; v3(44.04,16.09) 43.45,15.5 37.25,15.5 36.69,14.94 36.69,14.25 33.75,14.25 32.15,15.85 31.82,15.85 29.93,17.74 R10.2
D40SCL: length 80.9
  Top Layer w0.2: v1(63.4,20.05) 62.45,21 57.48,21 56.36,22.12 56.36,22.54 v1(54.63,24.27) ; 70.87,17.14 70.77,17.24 U5.29 69.53,17.21 69.07,17.21 68.96,17.32 68.96,16.92 68.56,16.52 68.16,16.52 67.96,16.33 v1(66.38,16.33) 64.82,17.88 v1(63.96,17.88)
  Bottom Layer w0.2: U17.4 63.71,20.37 v1(63.4,20.05) 63,19.65 R26.1 ; v1(63.96,17.88) 63.84,18 R26.1 ; v1(54.63,24.27) 50.78,24.27 49,22.5 49,21 47.25,19.25 47.25,13 41,6.75 23.25,6.75 21.31,4.81 U13.6 ; R26.1 63,18 62,19 59.75,19 59,18.25 U12.4 ; v1(66.38,16.33) 66.86,16.33 U4.2
D41SDA: length 85.7
  Top Layer w0.2: 70.84,18.51 U5.30 67.58,18.51 67.02,19.08 64.17,19.08 63.92,18.82 63.38,18.82 61.98,20.22 v1(61.09,20.22) 60.45,20.22 60.36,20.31 59.82,20.31 59.73,20.22 57.23,20.22 54.15,23.3 54.15,23.83 53.98,24 53.98,24.55 54.15,24.72 v1(54.15,25.1)
  Bottom Layer w0.2: U17.6 61.65,25.81 60.66,24.81 60.66,22.65 R31.1 ; v1(54.15,25.1) 50.6,25.1 48.25,22.75 48.25,21.25 45.75,18.75 45.75,14.71 42.04,11 38.75,11 35.5,7.75 33.5,7.75 32.5,8.75 27.15,8.75 26.15,7.75 23.5,7.75 23.06,7.31 22.39,7.31 22.38,7.3 22.04,7.3 19.51,4.77 19.51,3.74 U13.5 ; U12.2 58.5,19.39 R31.1 ; 67.08,17.41 65.94,17.41 64.44,18.91 v1(64.44,19.1) ; v1(61.09,20.22) 60.81,20.5 R31.1
D46PIRO2: length 47.5
  Top Layer w0.2: v1(37.25,12.8) 37.83,12.22 38.79,12.22 39.86,13.28 NOREF#16.TP1 50.43,12.22 53.9,12.22 54.1,12.02 54.11,12.02 54.43,11.7 55.62,11.7 56.36,12.45 U5.17 ; v1(19.92,14.26) v1(14.92,14.26)
  Bottom Layer w0.2: v1(19.92,14.26) 20.72,15.06 23.92,15.06 25.36,13.62 36.43,13.62 v1(37.25,12.8) ; v1(14.92,14.26) R6.2
D47: length 12.2
  Top Layer w0.2: U5.24 65.25,12.04 v1(64.9,11.68)
  Bottom Layer w0.2: SERVO3.2 62.38,3.83 62.38,5.99 64.49,8.1 64.49,11.28 v1(64.9,11.68)
D48: length 11.6
  Top Layer w0.2: U5.25 66.52,12.01 v1(65.81,11.3)
  Bottom Layer w0.2: SERVO3.3 64.39,3.3 64.39,5.82 65.66,7.09 65.66,11.15 v1(65.81,11.3)
D+: length 26.7
  Top Layer w0.2: 57.52,14.95 57.63,14.83 v3(57.63,14.8)
  Top Layer w0.254: 70.85,8.02 70.85,8.85 v3(71.4,9.41) 71.85,8.96 71.85,8.02 ; 57.52,14.95 57.33,15.13 53.49,15.13 53.06,14.7 52.06,14.7
  Bottom Layer w0.254: v3(57.63,14.8) 58.1,14.8 58.43,15.13 61.33,15.13 63.2,13.26 66.24,13.26 66.63,12.87 66.63,11.62 69.58,8.67 70.66,8.67 v3(71.4,9.41)
D-: length 26.6
  Top Layer w0.2: USBC1.A7 71.35,7.18 70.99,6.82 ; USBC1.B7 70.35,10.08 v3(70.28,10.15)
  Top Layer w0.254: USBC1.B7 70.42,7.95 70.42,7.26 70.86,6.82 70.99,6.82 ; U5.13 53.06,15.97 53.49,15.54 57.29,15.54 57.43,15.67 v3(57.77,15.67)
  Bottom Layer w0.254: 70.3,10.16 70.31,10.17 70.41,10.17 70.4,10.16 70.3,10.16 ; 70.3,10.16 v3(70.28,10.15) ; 70.3,10.16 69.05,10.16 67.04,12.17 67.04,13.04 66.41,13.66 63.37,13.66 61.5,15.54 58.48,15.54 58.35,15.67 v3(57.77,15.67)
EN: length 27.1
  Top Layer w0.2: v1(50.27,28.66) 52.05,28.66 U5.3
  Top Layer w0.3: C14.1 46.77,28.66 v1(50.27,28.66)
  Bottom Layer w0.2: 38.16,16.84 40.41,16.84 40.71,16.54 42.93,16.54 44,17.61 44,18.5 46.68,21.18 46.68,22.18 50.27,25.77 v1(50.27,28.66)
IO0: length 58.8
  Top Layer w0.2: 69.56,14.7 NOREF#4.TP14 71.19,14.37 69.8,12.98 69.8,12.55 68.86,11.61 67.64,11.61 66.62,10.59 57.09,10.59 56.25,9.75 v1(46.75,9.75)
  Bottom Layer w0.2: U13.7 23.85,4.57 24.51,5.23 25.5,5.23 ; v1(46.75,9.75) 46.75,8.5 43.5,5.25 25.5,5.25 25.5,5.23 ; 25.5,5.23 28.16,5.23 28.3,5.1
MISO: length 90.1
  Top Layer w0.2: U5.9 53.26,21.05 54.03,21.82 v1(54.55,21.82) 53.49,22.88 53.49,26.85 54.51,27.86 54.51,31.13 54.52,31.14 52.41,33.25 31.18,33.25 30.83,32.89 30.83,31.39 ; 30.83,32.9 30.45,33.27 26.7,33.27 26.52,33.45 22.82,33.45 10.76,21.38 v1(10.75,21.38)
  Bottom Layer w0.2: v1(10.75,21.38) 9.72,20.36 9.72,18.66 ; v1(54.55,21.82) 54.55,20.17 54.53,20.16 54.53,19.28 52.5,17.25 52.5,9.65 U15.7
MOSI: length 80
  Top Layer w0.2: v1(9.07,19.94) 10.23,19.94 11.4,21.11 11.4,21.46 12.26,22.32 27.94,22.32 28.52,22.9 28.52,23.17 ; 28.52,23.17 28.52,29.65 28.29,29.89 28.29,31.39 ; 28.52,23.17 41.97,23.17 43.5,21.64 48.14,21.64 48.25,21.75 48.25,21.82 48.75,22.32 NOREF#7.TP9 52.06,22.32 52.04,22.33 v1(49.84,22.33)
  Bottom Layer w0.2: 8.62,18.66 8.62,19.5 v1(9.07,19.94) ; U15.6 49,8.69 49,15.5 48.66,15.84 48.66,19.65 49.84,20.83 v1(49.84,22.33)
PIRO1-: length 6.1
  Bottom Layer w0.7: Q10.3 6.81,4.8 U13.1
PIRO2-: length 5.7
  Bottom Layer w0.7: U13.2 11.15,5.59 11.89,6.32 Q9.3
PIRO3-: length 6.7
  Bottom Layer w0.7: Q8.3 13.69,5.41 U13.3
PIRO4-: length 8.5
  Bottom Layer w0.7: U13.4 16.47,3 18.07,4.6 18.07,5.56 20.96,8.45 21.92,8.45
PPS: length 7.8
  Top Layer w0.2: 69.56,19.78 70.77,19.78 72.23,18.32 72.23,17.69 U6.1
RX: length 13.2
  Top Layer w0.3: 75.04,17.16 74.71,17.49 74.14,17.49 NOREF#5.TP4 72.37,19.26 72.37,25.49 71.83,26.02 NOREF.TP2 69.17,26.02
TX: length 12.1
  Top Layer w0.3: 69.17,27.29 69.27,27.39 NOREF#2.TP1 72.49,27.39 73.51,26.38 NOREF#18.TP3 74.98,19.7 75.04,19.7
V: length 32.1
  Top Layer w0.2: 94.18,25.06 94.18,27.08 R34.2 92.2,29.12 92.2,31.82 90.96,33.07 73.53,33.07 70.4,29.94 69.56,29.94
$1N5: length 7.6
  Bottom Layer w0.2: C15.2 38.83,20.31 38.18,19.66 38.18,18.95 R12.1 37.22,18 35.75,18 34.75,17 EN1.2
$1N13: length 2.4
  Top Layer w0.3: 86.7,12.8 R21.1
  Top Layer w0.5: 86.7,12.8 85.78,13.72 85.78,14.37
$1N14: length 2.8
  Top Layer w0.3: U2.8 87.32,14.09 88.57,14.09 88.7,14.22 C1.1
$1N15: length 3
  Top Layer w0.7: U2.6 84.79,14.08 C2.1
  Top Layer w0.8: 84.51,14.37 84.51,13.57
$1N16: length 11.7
  Top Layer w0.8: 88.08,29.33 86.72,29.33 85.96,28.57 85.96,24.52 D1.1 84.51,23.07 U2.3
$1N18: length 4
  Top Layer w0.7: 83.24,14.37 82.81,13.94 R24.2 81.4,13.75 R30.1
$1N20: length 9.4
  Top Layer w0.7: v3(88.44,25.9) 88.44,26.5 C6.1 ; U2.1 87.15,19.81 v3(88.19,19.81)
  Bottom Layer w0.75: v3(88.44,25.9) 87.75,25.21 87.75,20.25 v3(88.19,19.81)
$1N1285: length 2.3
  Top Layer w0.8: C2.2 84.55,10.53 82.63,10.53
$1N7934: length 2
  Top Layer w0.7: C25.2 R32.1
$1N12300: length 6.5
  Top Layer w0.2: 33.49,6.85 33.33,7 33.33,8.88 33.22,8.99 31.22,8.99 30.95,8.73 30.95,6.85
$1N13611: length 3.7
  Top Layer w0.2: U5.26 68.56,12.68 v1(68.56,12.26)
  Bottom Layer w0.2: R36.2 69.5,11.33 v1(68.56,12.26)
$1N13616: length 4.7
  Top Layer w0.2: v1(54.99,12.36) 55.09,12.46 U5.16
  Bottom Layer w0.2: R37.1 55.12,12.48 v1(54.99,12.36)
$1N14866: length 11.7
  Top Layer w0.2: R13.1 77.11,8.37 v3(77.11,7.36)
  Top Layer w0.254: 69.85,8.03 69.85,8.02 ; 69.85,8.02 69.85,7.1 v3(71.07,5.88) ; 69.85,8.02 69.84,8.03 69.83,8.03
  Bottom Layer w0.2: v3(71.07,5.88) 76.06,5.88 77.11,6.93 v3(77.11,7.36)
$1N14869: length 3.2
  Top Layer w0.2: 72.85,8.02 72.85,10.88 R38.2
$2N1: length 4.2
  Bottom Layer w0.8: R2.1 21.3,12.74 20.97,12.41 Q7.1
$2N2: length 4.5
  Bottom Layer w0.254: 15.83,13.55 15.86,13.55 15.96,13.45 ; 15.96,11.54 15.76,11.34
  Bottom Layer w0.7: 15.83,14.26 15.96,14.26 15.96,12.74 15.76,12.54 Q8.1
$2N3: length 5.1
  Bottom Layer w0.254: 10.94,11.34 11.24,11.64 11.26,11.64 11.26,12.36
  Bottom Layer w0.7: R6.1 10.94,13.94 10.94,11.34 Q9.1
$2N4: length 4.3
  Bottom Layer w0.8: Q10.1 5.86,12.16 6.18,12.48 6.18,14.26 R7.1
$2N19: length 6
  Bottom Layer w0.2: U4.3 65.04,16.98 64.82,16.76 64.82,16.36 64.93,16.24 65.53,16.24 65.93,15.85 65.93,15.38 66.81,15.38 U4.1
$2N22: length 1.4
  Bottom Layer w0.2: U4.24 67.71,15.74 67.71,15.34 67.77,15.29 67.77,14.44
$2N907: length 1.7
  Bottom Layer w0.4: 27.93,20.89 LED1.4
$2N956: length 2.1
  Top Layer w0.7: R20.1 76.47,30.81 LED2.1
$2N973: length 1.7
  Bottom Layer w0.2: U4.21 68.95,15.09 C22.1
$2N3959: length 11.5
  Top Layer w0.2: v1(35.27,27) 33.2,24.93 v1(33.2,24.79)
  Bottom Layer w0.2: v1(35.27,27) BUZZER1.4 37.98,29.53 Q11.3 ; v1(33.2,24.79) 31.64,23.23 BUZZER1.2
$2N14318: length 6
  Bottom Layer w0.2: Q11.1 43.32,27.13 R33.1 43.4,25.14 R9.1

## Copper pours and planes (outline as drawn; the poured copper is in the pictures)
GND on Top Layer: 79.17,24.51 81.2,24.51 81.08,24.38 81.08,21.71 80.82,21.46 79.17,21.46
GND on Top Layer: 81.84,15.62 87.68,15.62 87.68,18.66 81.84,18.66
GND on Top Layer: 61.32,25.49 57.38,25.49 57.38,21.42 61.19,21.42 61.32,21.55
GND on Top Layer: 82.6,16.12 82.09,15.62 81.2,15.62 80.31,16.51 80.31,18.54 80.44,18.66 80.44,20.32 79.41,21.47 80.95,21.59 82.6,21.46
GND on Top Layer: 83.74,18.54 83.74,21.46 82.35,21.46 82.47,21.33 82.47,18.54
GND on Inner1: 75.56,3.53 76.73,3.53 76.73,2.62 75.56,2.62
GND on Inner1: 65.41,7.76 66.68,7.76 66.68,6.75 65.41,6.75
GND on Inner1: 30.16,2.56 31.06,2.56 31.06,1.39 30.16,1.39
GND on Inner1: 94.49,13 95.76,13 95.76,12 94.49,12
GND on Inner1: 29,3.45 30.17,3.45 30.17,2.55 29,2.55
GND on Inner1: 66.91,3.53 68.08,3.53 68.08,2.62 66.91,2.62
GND on Inner1: 30.16,4.61 31.06,4.61 31.06,3.44 30.16,3.44
GND on Inner1: 93.5,12.01 94.5,12.01 94.5,10.74 93.5,10.74
GND on Inner1: 92.24,13 93.51,13 93.51,12 92.24,12
GND on Inner1: 93.5,14.26 94.5,14.26 94.5,12.99 93.5,12.99
GND on Inner1: 74.11,3.53 75.28,3.53 75.28,2.62 74.11,2.62
GND on Inner1: 65.46,3.53 66.63,3.53 66.63,2.62 65.46,2.62
GND on Inner1: 0.15,33.84 99.88,33.84 99.88,0.15 0.15,0.15
GND on Inner2: 30.16,4.61 31.06,4.61 31.06,3.44 30.16,3.44
GND on Inner2: 29,3.45 30.17,3.45 30.17,2.55 29,2.55
GND on Inner2: 93.5,12.01 94.5,12.01 94.5,10.74 93.5,10.74
GND on Inner2: 65.46,3.53 66.63,3.53 66.63,2.62 65.46,2.62
GND on Inner2: 0.15,33.84 99.88,33.84 99.88,0.15 0.15,0.15
GND on Inner2: 65.41,7.76 66.68,7.76 66.68,6.75 65.41,6.75
GND on Inner2: 74.11,3.53 75.28,3.53 75.28,2.62 74.11,2.62
GND on Inner2: 93.5,14.26 94.5,14.26 94.5,12.99 93.5,12.99
GND on Inner2: 92.24,13 93.51,13 93.51,12 92.24,12
GND on Inner2: 30.16,2.56 31.06,2.56 31.06,1.39 30.16,1.39
GND on Inner2: 66.91,3.53 68.08,3.53 68.08,2.62 66.91,2.62
GND on Inner2: 94.49,13 95.76,13 95.76,12 94.49,12
GND on Inner2: 75.56,3.53 76.73,3.53 76.73,2.62 75.56,2.62
VBATT on Top Layer: 90,22.5 97,22.5 97,14.75 90,14.75
$1N16 on Top Layer: 85.7,22.22 83.52,22.22 83.52,31.62 89.59,31.62 89.84,31.36 89.84,28.7 89.71,28.57 87.17,28.57 87.05,28.44 87.05,23.04 87,23 87,22.94

Small or netless copper shapes (teardrops, artwork), in the pictures only: 1 on Top Layer, 12 on Inner1, 12 on Inner2

## Text on the board
Bottom Silkscreen Layer: 01 | 02 | 03 | 04 | SDA | SCL | IO0 | VCC | GND | 5+ | D11 | D12 | D13 | MOSI | MISO | CLK
Top Silkscreen Layer: +
